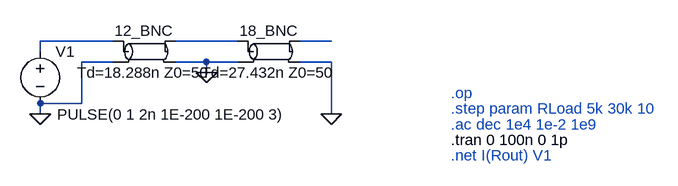
[diagram p0: schematic 2a.asc]
2a.asc, the LTspice schematic file:
Version 4
SHEET 1 1144 680
WIRE 304 432 192 432
WIRE 496 432 400 432
WIRE 640 432 592 432
WIRE 192 448 192 432
WIRE 304 464 256 464
WIRE 448 464 400 464
WIRE 496 464 448 464
WIRE 640 464 592 464
WIRE 448 480 448 464
WIRE 256 528 256 464
WIRE 256 528 192 528
WIRE 192 544 192 528
WIRE 640 544 640 464
FLAG 448 480 0
FLAG 192 544 0
FLAG 640 544 0
SYMBOL tline 352 448 R0
SYMATTR InstName 12_BNC
SYMATTR Value Td=18.288n Z0=50
SYMBOL Voltage 192 432 R0
WINDOW 3 26 113 Left 2
SYMATTR Value PULSE(0 1 2n 1E-200 1E-200 3)
SYMATTR InstName V1
SYMATTR SpiceLine Rser=50
SYMBOL tline 544 448 R0
SYMATTR InstName 18_BNC
SYMATTR Value Td=27.432n Z0=50
TEXT 824 512 Left 2 ;.op
TEXT 824 536 Left 2 ;.step param RLoad 5k 30k 10
TEXT 824 560 Left 2 ;.ac dec 1e4 1e-2 1e9
TEXT 824 584 Left 2 !.tran 0 100n 0 1p
TEXT 824 608 Left 2 ;.net I(Rout) V1

The netlist it stands for:
* 2a.asc
T§12_BNC N001 0 N002 0 Td=18.288n Z0=50
V1 N001 0 PULSE(0 1 2n 1E-200 1E-200 3) Rser=50
T§18_BNC N002 0 N003 0 Td=27.432n Z0=50
* .op
* .step param RLoad 5k 30k 10
* .ac dec 1e4 1e-2 1e9
.tran 0 100n 0 1p
* .net I(Rout) V1
.backanno
.end